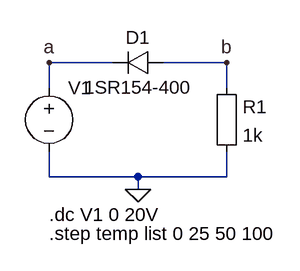
[diagram p0: schematic diode-va-reverse.asc]
diode-va-reverse.asc, the LTspice schematic file:
Version 4
SHEET 1 880 680
WIRE 16 208 -64 208
WIRE 160 208 80 208
WIRE -64 240 -64 208
WIRE 160 240 160 208
WIRE -64 352 -64 320
WIRE 48 352 -64 352
WIRE 160 352 160 320
WIRE 160 352 48 352
WIRE 48 368 48 352
FLAG -64 208 a
FLAG 160 208 b
FLAG 48 368 0
SYMBOL diode 80 192 R90
WINDOW 0 0 32 VBottom 2
WINDOW 3 32 32 VTop 2
SYMATTR InstName D1
SYMATTR Value 1SR154-400
SYMBOL Misc\\EuropeanResistor 144 224 R0
SYMATTR InstName R1
SYMATTR Value 1k
SYMBOL voltage -64 224 R0
SYMATTR InstName V1
SYMATTR Value ""
TEXT -64 400 Left 2 !.dc V1 0 20V
TEXT -64 424 Left 2 !.step temp list 0 25 50 100

The netlist it stands for:
* diode-va-reverse.asc
D1 b a 1SR154-400
R1 b 0 1k
V1 a 0
.model D D
.lib standard.dio
.dc V1 0 20V
.step temp list 0 25 50 100
.backanno
.end